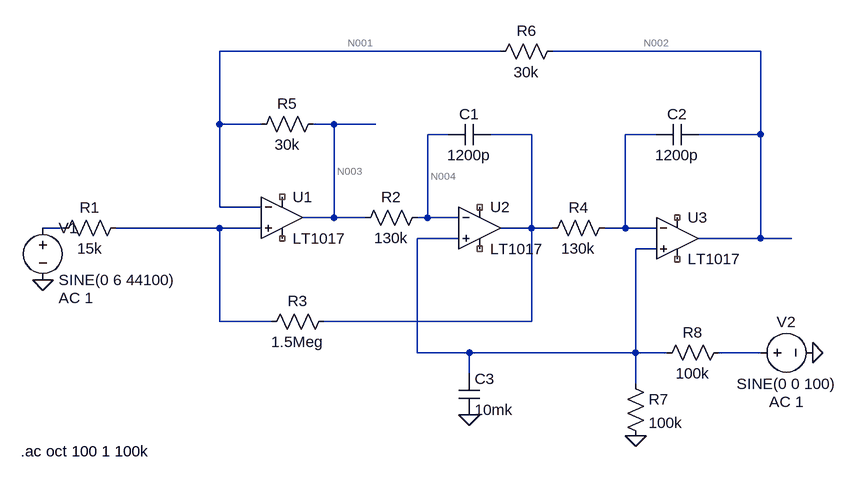
[diagram p0: schematic Draft2.asc]
Draft2.asc, the LTspice schematic file:
Version 4
SHEET 1 888 680
WIRE 368 -112 -64 -112
WIRE 768 -112 448 -112
WIRE -64 0 -64 -112
WIRE 0 0 -64 0
WIRE 112 0 80 0
WIRE 176 0 112 0
WIRE 288 16 256 16
WIRE 416 16 352 16
WIRE 608 16 560 16
WIRE 768 16 768 -112
WIRE 768 16 672 16
WIRE -64 128 -64 0
WIRE 0 128 -64 128
WIRE 112 144 112 0
WIRE 112 144 64 144
WIRE 160 144 112 144
WIRE 256 144 256 16
WIRE 256 144 240 144
WIRE 304 144 256 144
WIRE -304 160 -336 160
WIRE -64 160 -224 160
WIRE 0 160 -64 160
WIRE 416 160 416 16
WIRE 416 160 368 160
WIRE 448 160 416 160
WIRE 560 160 560 16
WIRE 560 160 528 160
WIRE 608 160 560 160
WIRE 304 176 240 176
WIRE 768 176 768 16
WIRE 768 176 672 176
WIRE 816 176 768 176
WIRE 608 192 576 192
WIRE -64 304 -64 160
WIRE 16 304 -64 304
WIRE 416 304 416 160
WIRE 416 304 96 304
WIRE 240 352 240 176
WIRE 320 352 240 352
WIRE 576 352 576 192
WIRE 576 352 320 352
WIRE 624 352 576 352
WIRE 768 352 704 352
WIRE 320 384 320 352
WIRE 576 400 576 352
FLAG 320 448 0
FLAG 576 480 0
FLAG -336 240 0
FLAG 848 352 0
SYMBOL Comparators\\LT1017 32 144 R0
SYMATTR InstName U1
SYMBOL Comparators\\LT1017 336 160 R0
SYMATTR InstName U2
SYMBOL Comparators\\LT1017 640 176 R0
SYMATTR InstName U3
SYMBOL res -208 144 R90
WINDOW 0 0 56 VBottom 2
WINDOW 3 32 56 VTop 2
SYMATTR InstName R1
SYMATTR Value 15k
SYMBOL res 256 128 R90
WINDOW 0 0 56 VBottom 2
WINDOW 3 32 56 VTop 2
SYMATTR InstName R2
SYMATTR Value 130k
SYMBOL res 112 288 R90
WINDOW 0 0 56 VBottom 2
WINDOW 3 32 56 VTop 2
SYMATTR InstName R3
SYMATTR Value 1.5Meg
SYMBOL res 544 144 R90
WINDOW 0 0 56 VBottom 2
WINDOW 3 32 56 VTop 2
SYMATTR InstName R4
SYMATTR Value 130k
SYMBOL res 96 -16 R90
WINDOW 0 0 56 VBottom 2
WINDOW 3 32 56 VTop 2
SYMATTR InstName R5
SYMATTR Value 30k
SYMBOL res 464 -128 R90
WINDOW 0 0 56 VBottom 2
WINDOW 3 32 56 VTop 2
SYMATTR InstName R6
SYMATTR Value 30k
SYMBOL res 560 384 R0
SYMATTR InstName R7
SYMATTR Value 100k
SYMBOL res 720 336 R90
WINDOW 0 0 56 VBottom 2
WINDOW 3 32 56 VTop 2
SYMATTR InstName R8
SYMATTR Value 100k
SYMBOL cap 352 0 R90
WINDOW 0 0 32 VBottom 2
WINDOW 3 32 32 VTop 2
SYMATTR InstName C1
SYMATTR Value 1200p
SYMBOL cap 672 0 R90
WINDOW 0 0 32 VBottom 2
WINDOW 3 32 32 VTop 2
SYMATTR InstName C2
SYMATTR Value 1200p
SYMBOL cap 304 384 R0
SYMATTR InstName C3
SYMATTR Value 10mk
SYMBOL voltage -336 144 R0
WINDOW 123 24 124 Left 2
WINDOW 39 0 0 Left 2
SYMATTR InstName V1
SYMATTR Value SINE(0 6 44100)
SYMATTR Value2 AC 1
SYMBOL voltage 752 352 R270
WINDOW 0 32 56 VTop 2
WINDOW 3 -32 56 VBottom 2
WINDOW 123 -60 56 VBottom 2
WINDOW 39 0 0 Left 2
SYMATTR InstName V2
SYMATTR Value SINE(0 0 100)
SYMATTR Value2 AC 1
TEXT -370 504 Left 2 !.ac oct 100 1 100k

The netlist it stands for:
* Draft2.asc
XU1 N008 N001 NC_01 NC_02 N003 LT1017  ; pins In+ In- V+ V- OUT
XU2 N009 N004 NC_03 NC_04 N005 LT1017  ; pins In+ In- V+ V- OUT
XU3 N009 N006 NC_05 NC_06 N002 LT1017  ; pins In+ In- V+ V- OUT
R1 N008 N007 15k
R2 N004 N003 130k
R3 N005 N008 1.5Meg
R4 N006 N005 130k
R5 N003 N001 30k
R6 N002 N001 30k
R7 N009 0 100k
R8 N010 N009 100k
C1 N005 N004 1200p
C2 N002 N006 1200p
C3 N009 0 10mk
V1 N007 0 SINE(0 6 44100) AC 1
V2 N010 0 SINE(0 0 100) AC 1
.ac oct 100 1 100k
.backanno
.end

* Results of the author's LTspice run, read from the files saved beside the schematic
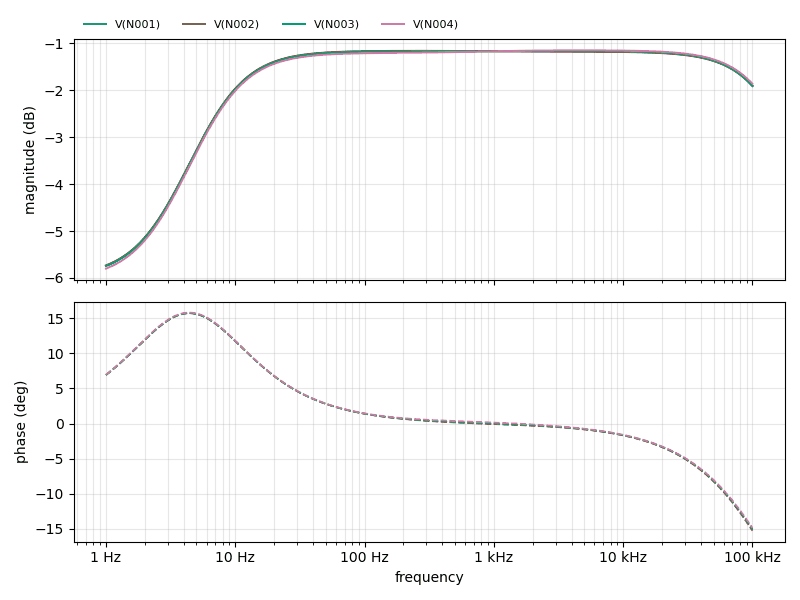
[diagram p1: AC Analysis of Draft2.asc, plotted from the saved traces]
* AC Analysis, 1 run:
*   V(N001): -5.73 dB at 1 Hz, -1.91 dB at 100 kHz, peak -1.16 dB at 340.1 Hz, 3 dB below the peak at 3.396 Hz
*   V(N002): -5.73 dB at 1 Hz, -1.91 dB at 100 kHz, peak -1.16 dB at 257.8 Hz, 3 dB below the peak at 3.398 Hz
*   V(N003): -5.75 dB at 1 Hz, -1.91 dB at 100 kHz, peak -1.16 dB at 2.402 kHz, 3 dB below the peak at 3.409 Hz
*   V(N004): -5.80 dB at 1 Hz, -1.86 dB at 100 kHz, peak -1.15 dB at 4.608 kHz, 3 dB below the peak at 3.502 Hz